# Altium project SISPS-PV-PCB.PrjPcb (part 4 of 4)

## Sheet USB-UART Converter (CP2102).SchDoc: - - - - -
size A4; ApprovedBy: LD Stanton; Author: LD Stanton; CompanyName: University of Cape Town; DrawnBy: Lawrence Stanton; Engineer: Lawrence Stanton; Organization: University of Cape Town; Address1: Department of Electrical Engineering; Address2: Rondebosch; Address3: Cape Town; Address4: South Africa 7701; DocumentNumber: 16; SheetNumber: 16; SheetTotal: 20
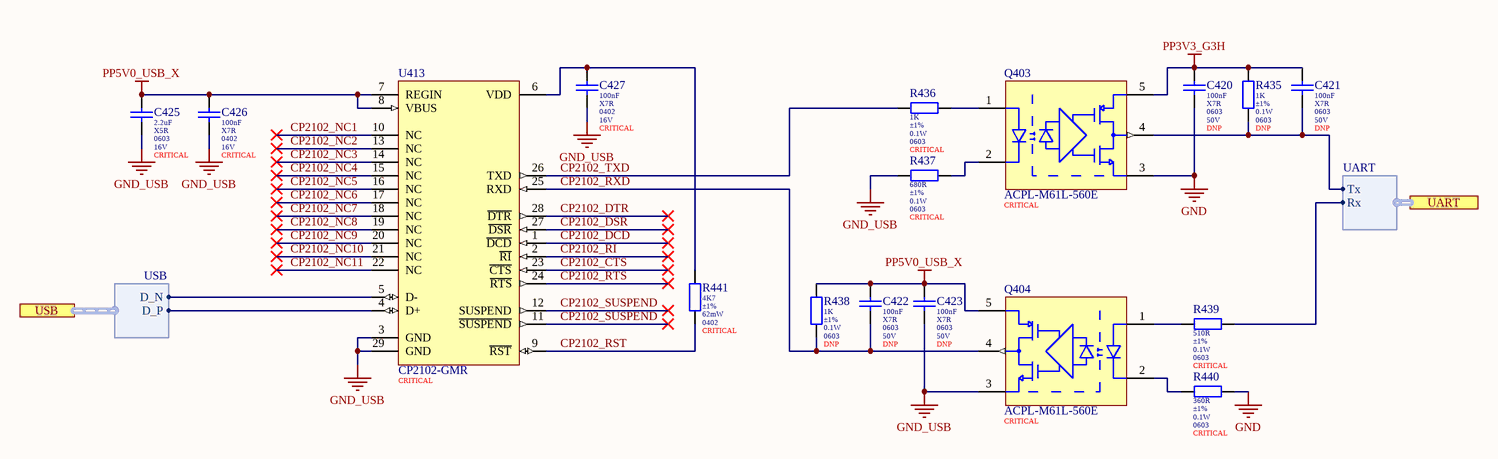
[diagram p15: USB-UART Converter (CP2102).SchDoc]

### Parts
C420  value 100nF  Dielectric: X7R  Package: 0603  Voltage: 50V  Populate: DNP  [0603 (Yageo DA) B]  (hidden comment: CC0603KRX7R9BB104)
C421  value 100nF  Dielectric: X7R  Package: 0603  Voltage: 50V  Populate: DNP  [0603 (Yageo DA) B]  (hidden comment: CC0603KRX7R9BB104)
C422  value 100nF  Dielectric: X7R  Package: 0603  Voltage: 50V  Populate: DNP  [0603 (Yageo DA) B]  (hidden comment: CC0603KRX7R9BB104)
C423  value 100nF  Dielectric: X7R  Package: 0603  Voltage: 50V  Populate: DNP  [0603 (Yageo DA) B]  (hidden comment: CC0603KRX7R9BB104)
C425  value 2.2uF  Dielectric: X5R  Package: 0603  Voltage: 16V  Populate: CRITICAL  [0603_080_8 (Samsung) B]  (hidden comment: CL10A225KO8NNNC)
C426  value 100nF  Dielectric: X7R  Package: 0402  Voltage: 16V  Populate: CRITICAL  [0402_050_5 (Samsumg) B]  (hidden comment: CL05B104KO5NNNC)
C427  value 100nF  Dielectric: X7R  Package: 0402  Voltage: 16V  Populate: CRITICAL  [0402_050_5 (Samsumg) B]  (hidden comment: CL05B104KO5NNNC)
Q403  ACPL-M61L-560E  Placement: CRITICAL  [SO-5 (ACPL) B]
Q404  ACPL-M61L-560E  Placement: CRITICAL  [SO-5 (ACPL) B]
R435  value 1K  Tolerance: ±1%  Power: 0.1W  Package: 0603  Populate: DNP  [0603 (Uniroyal) B]  (hidden comment: 0603WAF1001T5E)
R436  value 1K  Tolerance: ±1%  Power: 0.1W  Package: 0603  Populate: CRITICAL  [0603 (Uniroyal) B]  (hidden comment: 0603WAF1001T5E)
R437  value 680R  Tolerance: ±1%  Power: 0.1W  Package: 0603  Populate: CRITICAL  [0603 (Uniroyal) B]  (hidden comment: 0603WAF6800T5E)
R438  value 1K  Tolerance: ±1%  Power: 0.1W  Package: 0603  Populate: DNP  [0603 (Uniroyal) B]  (hidden comment: 0603WAF1001T5E)
R439  value 510R  Tolerance: ±1%  Power: 0.1W  Package: 0603  Populate: CRITICAL  [0603 (Uniroyal) B]  (hidden comment: 0603WAF5100T5E)
R440  value 360R  Tolerance: ±1%  Power: 0.1W  Package: 0603  Populate: CRITICAL  [0603 (Uniroyal) B]  (hidden comment: 0603WAF3600T5E)
R441  value 4K7  Tolerance: ±1%  Power: 62mW  Package: 0402  Populate: CRITICAL  [0402 (Uniroyal) C]  (hidden comment: 0402WGF4701TCE)
U413  CP2102-GMR  Placement: CRITICAL  [QFN28 (CP2102-GMR) C]

### Ports
UART (harness UART), USB (harness USB)

### Harnesses
USB: D_P, D_N
UART: Rx, Tx

### Nets
GND: C420.2 Q403.3(GND) R440.2
GND_USB: C423.2 C425.2 C426.2 C427.2 Q404.3(GND) R437.1 U413.3(GND) U413.29(GND)
PP3V3_G3H: C420.1 C421.1 Q403.5(VDD) R435.2
PP5V0_USB_X: C422.1 C423.1 C425.1 C426.1 Q404.5(VDD) R438.2 U413.7(REGIN) U413.8(VBUS)
CP2102_CTS: U413.23(~{CTS})
CP2102_DCD: U413.1(~{DCD})
CP2102_DSR: U413.27(~{DSR})
CP2102_DTR: U413.28(~{DTR})
CP2102_NC1: U413.10(NC)
CP2102_NC2: U413.13(NC)
CP2102_NC3: U413.14(NC)
CP2102_NC4: U413.15(NC)
CP2102_NC5: U413.16(NC)
CP2102_NC6: U413.17(NC)
CP2102_NC7: U413.18(NC)
CP2102_NC8: U413.19(NC)
CP2102_NC9: U413.20(NC)
CP2102_NC10: U413.21(NC)
CP2102_NC11: U413.22(NC)
CP2102_RI: U413.2(~{RI})
CP2102_RST: R441.2 U413.9(~{RST})
CP2102_RTS: U413.24(~{RTS})
CP2102_RXD: C422.2 Q404.4(VO) R438.1 U413.25(RXD)
CP2102_~{SUSPEND}: U413.11(~{SUSPEND})
CP2102_SUSPEND: U413.12(SUSPEND)
CP2102_TXD: R436.1 U413.26(TXD)
UART_USB.Rx: R439.2 ; port UART.Rx
UART_USB.Tx: C421.2 Q403.4(VO) R435.1 ; port UART.Tx
USB.D_N: U413.5(D-) ; port USB.D_N
USB.D_P: U413.4(D+) ; port USB.D_P
NetC427_1: C427.1 R441.1 U413.6(VDD)
NetQ403_1: Q403.1(A) R436.2
NetQ403_2: Q403.2(C) R437.2
NetQ404_1: Q404.1(A) R439.1
NetQ404_2: Q404.2(C) R440.1

### Notes on the sheet
- Size:
- Date:
- A4
- Number:
- Time:
- Revision:
- Sheet
- of
- File:
- Author:

### Library data of the parts
C420-C423 = CMP-047-000000-7: MLCC 100nF 50V 0603 X7R ±10%; Manufacturer: Yageo; LCSC Part Number: C14663; Tolerance: ±10%; ComponentLink1URL: https://datasheet.lcsc.com/szlcsc/YAGEO-CC0603KRX7R9BB104_C14663.pdf; ComponentLink1Description: Datasheet
C425 = CMP-045-000016-8: MLCC 2.2uF 0603 16V X5R ±10%; Manufacturer: Samsung; ComponentLink1URL: https://datasheet.lcsc.com/szlcsc/Samsung-Electro-Mechanics-CL05C100JB5NNNC_C32949.pdf; LCSC Part Number: C23630; Tolerance: ±10%; ComponentLink1Description: Datasheet
C426 C427 = CMP-045-000014-12: MLCC 100nF 0402 16V X7R ±10%; Manufacturer: Samsung; ComponentLink1Description: Datasheet; ComponentLink1URL: https://datasheet.lcsc.com/szlcsc/Samsung-Electro-Mechanics-CL05C100JB5NNNC_C32949.pdf; LCSC Part Number: C1525; Tolerance: ±10%
Q403 Q404 = CMP-00026-00000-1: Optocoupler Logic-Out Totem-Pole DC-IN 1-CH SO-5; Propagation Delay: 80ns; Forward Voltage: 1.3V; Forward Current: 2mA; Output Current: 10mA; Isolation Voltage: 3.75kV; ComponentLink1URL: https://datasheet.lcsc.com/lcsc/1912111437_AVAGO-Broadcom-ACPL-M61L-500E_C44908.pdf; Case/Package: SO; ComponentLink1Description: Datasheet; LCSC Part Number: C691956; Min Operating Temperature: -40°C; Max Operating Temperature: 105°C; RoHS Compliant: Yes
R435 R436 R438 = CMP-010-000308-10: Resistor 1K0 0603 ±1% Thick Film Uniroyal; Working Voltage: 50V; Temperature Coefficient: ±100ppm/K; ComponentLink1URL: https://datasheet.lcsc.com/szlcsc/1811062009_UNI-ROYAL-Uniroyal-Elec-0603WAF1002T5E_C25804.pdf; LCSC Part Number: C21190; Pin Count: 2; Manufacturer: Uniroyal; ComponentLink1Description: Datasheet; Temperature: -55 - 155°C
R437 = CMP-010-000394-2: Resistor 680R 0603 ±1% Thick Film Uniroyal; Working Voltage: 50V; Temperature Coefficient: ±100ppm/K; ComponentLink1Description: Datasheet; Pin Count: 2; ComponentLink1URL: https://datasheet.lcsc.com/szlcsc/1811062009_UNI-ROYAL-Uniroyal-Elec-0603WAF1002T5E_C25804.pdf; Temperature: -55 - 155°C; Manufacturer: Uniroyal; LCSC Part Number: C23228
R439 = CMP-010-000390-1: Resistor 510R 0603 ±1% Thick Film Uniroyal; Temperature Coefficient: ±200ppm/K; Working Voltage: 50V; Pin Count: 2; LCSC Part Number: C23193; ComponentLink1URL: https://datasheet.lcsc.com/szlcsc/1811062009_UNI-ROYAL-Uniroyal-Elec-0603WAF1002T5E_C25804.pdf; Temperature: -55 - 155°C; Manufacturer: Uniroyal; ComponentLink1Description: Datasheet
R440 = CMP-010-000392-1: Resistor 360R 0603 ±1% Thick Film Uniroyal; Working Voltage: 50V; Temperature Coefficient: ±200ppm/K; ComponentLink1URL: https://datasheet.lcsc.com/szlcsc/1811062009_UNI-ROYAL-Uniroyal-Elec-0603WAF1002T5E_C25804.pdf; LCSC Part Number: C25194; Temperature: -55 - 155°C; Pin Count: 2; Manufacturer: Uniroyal; ComponentLink1Description: Datasheet
R441 = CMP-010-000338-12: Resistor 4K7 0402 ±1% Thick Film Uniroyal; Temperature Coefficient: ±100ppm/K; Working Voltage: 50V; Temperature: -55 - 155°C; ComponentLink1URL: https://datasheet.lcsc.com/szlcsc/1811062009_UNI-ROYAL-Uniroyal-Elec-0603WAF1002T5E_C25804.pdf; Manufacturer: Uniroyal; LCSC Part Number: C25900; Pin Count: 2; ComponentLink1Description: Datasheet
U413 = CMP-000046-6: USB to UART Bridge QFN28; ComponentLink1Description: Datasheet; Max Operating Temperature: 85°C; LCSC Part Number: C6568; ComponentLink1URL: https://datasheet.lcsc.com/lcsc/1811081920_SILICON-LABS-CP2102-GMR_C6568.pdf; RoHS Compliant: Yes; Case/Package: QFN

## Sheet USB-UART Converter (FT232).SchDoc: Optoisolated USB to UART Converter
size A4; ApprovedBy: LD Stanton; Author: LD Stanton; CompanyName: University of Cape Town; DrawnBy: Lawrence Stanton; Engineer: Lawrence Stanton; Organization: University of Cape Town; Address1: Department of Electrical Engineering; Address2: Rondebosch; Address3: Cape Town; Address4: South Africa 7701; DocumentNumber: 15; SheetNumber: 15; SheetTotal: 20
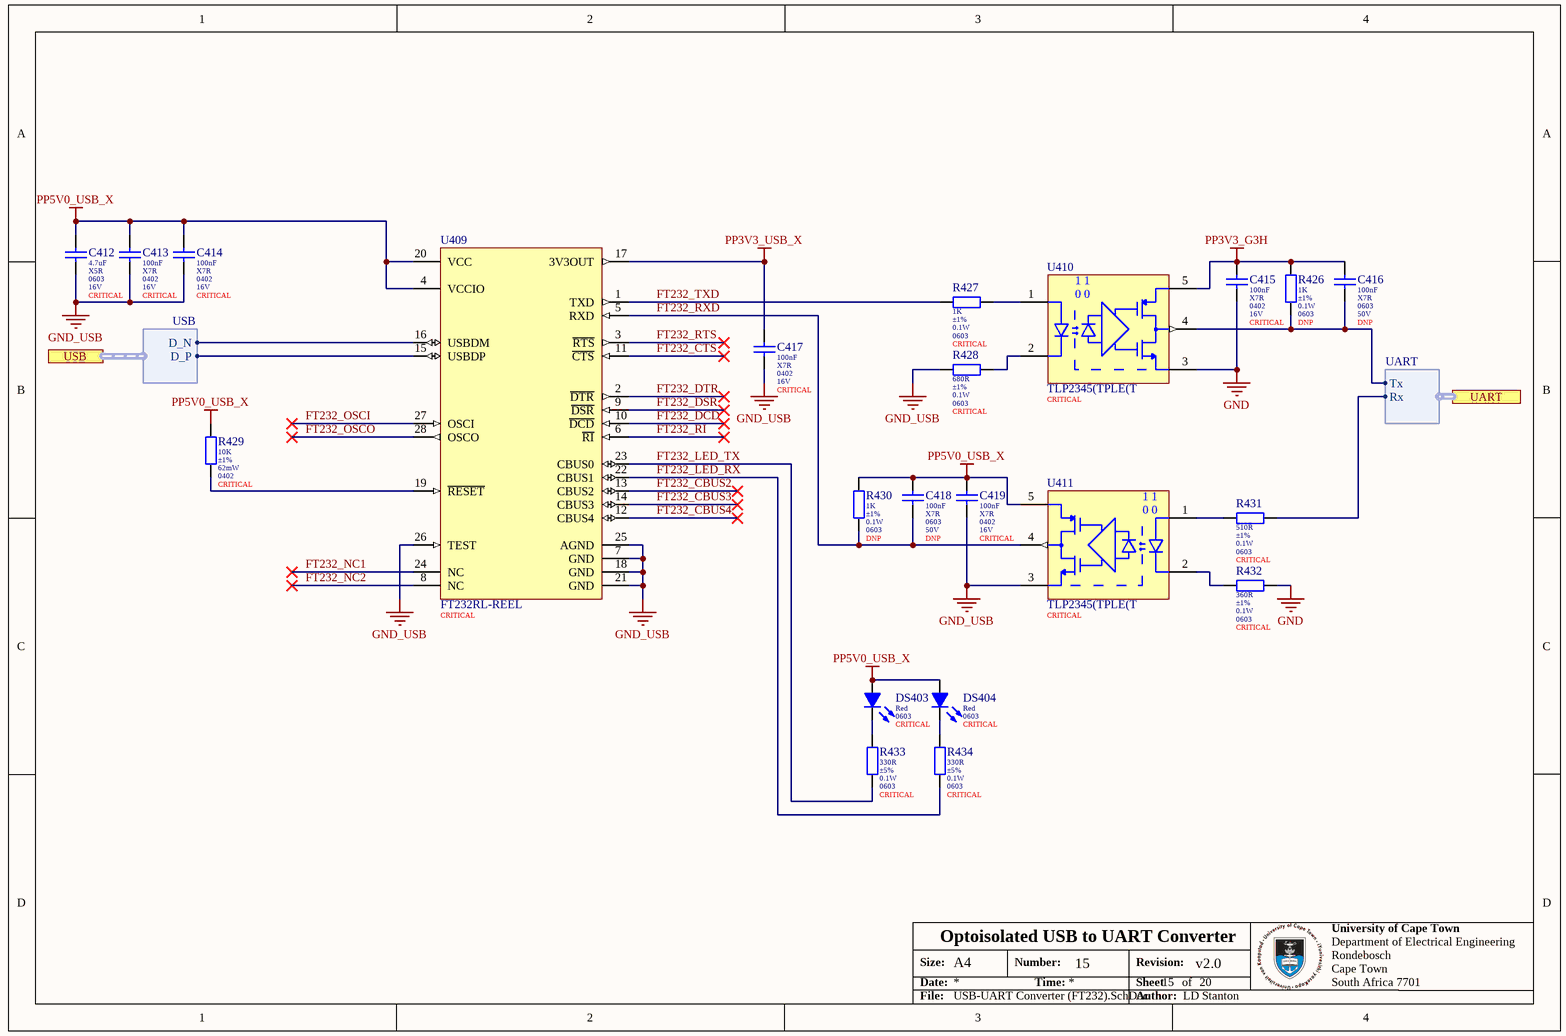
[diagram p16: USB-UART Converter (FT232).SchDoc]

### Parts
C412  value 4.7uF  Dielectric: X5R  Package: 0603  Voltage: 16V  Populate: CRITICAL  [0603_080_8 (Samsung) B]  (hidden comment: CL10A475KO8NNNC)
C413  value 100nF  Dielectric: X7R  Package: 0402  Voltage: 16V  Populate: CRITICAL  [0402_050_5 (Samsumg) B]  (hidden comment: CL05B104KO5NNNC)
C414  value 100nF  Dielectric: X7R  Package: 0402  Voltage: 16V  Populate: CRITICAL  [0402_050_5 (Samsumg) B]  (hidden comment: CL05B104KO5NNNC)
C415  value 100nF  Dielectric: X7R  Package: 0402  Voltage: 16V  Populate: CRITICAL  [0402_050_5 (Samsumg) B]  (hidden comment: CL05B104KO5NNNC)
C416  value 100nF  Dielectric: X7R  Package: 0603  Voltage: 50V  Populate: DNP  [0603 (Yageo DA) B]  (hidden comment: CC0603KRX7R9BB104)
C417  value 100nF  Dielectric: X7R  Package: 0402  Voltage: 16V  Populate: CRITICAL  [0402_050_5 (Samsumg) B]  (hidden comment: CL05B104KO5NNNC)
C418  value 100nF  Dielectric: X7R  Package: 0603  Voltage: 50V  Populate: DNP  [0603 (Yageo DA) B]  (hidden comment: CC0603KRX7R9BB104)
C419  value 100nF  Dielectric: X7R  Package: 0402  Voltage: 16V  Populate: CRITICAL  [0402_050_5 (Samsumg) B]  (hidden comment: CL05B104KO5NNNC)
DS403  Colour: Red  Package: 0603  Placement: CRITICAL  [LED 0603 (Everlight) B]  (hidden comment: 19-217/R6C-AL1M2VY/3T)
DS404  Colour: Red  Package: 0603  Placement: CRITICAL  [LED 0603 (Everlight) B]  (hidden comment: 19-217/R6C-AL1M2VY/3T)
R426  value 1K  Tolerance: ±1%  Power: 0.1W  Package: 0603  Populate: DNP  [0603 (Uniroyal) B]  (hidden comment: 0603WAF1001T5E)
R427  value 1K  Tolerance: ±1%  Power: 0.1W  Package: 0603  Populate: CRITICAL  [0603 (Uniroyal) B]  (hidden comment: 0603WAF1001T5E)
R428  value 680R  Tolerance: ±1%  Power: 0.1W  Package: 0603  Populate: CRITICAL  [0603 (Uniroyal) B]  (hidden comment: 0603WAF6800T5E)
R429  value 10K  Tolerance: ±1%  Power: 62mW  Package: 0402  Populate: CRITICAL  [0402 (Uniroyal) B]  (hidden comment: 0402WGF1002TCE)
R430  value 1K  Tolerance: ±1%  Power: 0.1W  Package: 0603  Populate: DNP  [0603 (Uniroyal) B]  (hidden comment: 0603WAF1001T5E)
R431  value 510R  Tolerance: ±1%  Power: 0.1W  Package: 0603  Populate: CRITICAL  [0603 (Uniroyal) B]  (hidden comment: 0603WAF5100T5E)
R432  value 360R  Tolerance: ±1%  Power: 0.1W  Package: 0603  Populate: CRITICAL  [0603 (Uniroyal) B]  (hidden comment: 0603WAF3600T5E)
R433  value 330R  Tolerance: ±5%  Power: 0.1W  Package: 0603  Populate: CRITICAL  [0603 (Uniroyal) B]  (hidden comment: 0603WAJ0331T5E)
R434  value 330R  Tolerance: ±5%  Power: 0.1W  Package: 0603  Populate: CRITICAL  [0603 (Uniroyal) B]  (hidden comment: 0603WAJ0331T5E)
U409  FT232RL-REEL  Placement: CRITICAL  [SSOP-28 (FT232) B]
U410  TLP2345(TPLE(T  Placement: CRITICAL  [SO-5 (TLP23) B]
U411  TLP2345(TPLE(T  Placement: CRITICAL  [SO-5 (TLP23) B]

### Ports
UART (harness UART), USB (harness USB)

### Harnesses
UART: Rx, Tx
USB: D_P, D_N

### Nets
GND: C415.2 R432.2 U410.3(GND)
GND_USB: C412.2 C413.2 C414.2 C417.2 C419.2 R428.1 U409.7(GND) U409.18(GND) U409.21(GND) U409.25(AGND) U409.26(TEST) U411.3(GND)
PP3V3_G3H: C415.1 C416.1 R426.2 U410.5(VDD)
PP3V3_USB_X: C417.1 U409.17(3V3OUT)
PP5V0_USB_X: C412.1 C413.1 C414.1 C418.1 C419.1 DS403.A DS404.A R429.1 R430.2 U409.4(VCCIO) U409.20(VCC) U411.5(VDD)
FT232_CBUS2: U409.13(CBUS2)
FT232_CBUS3: U409.14(CBUS3)
FT232_CBUS4: U409.12(CBUS4)
FT232_CTS: U409.11(~{CTS})
FT232_DCD: U409.10(~{DCD})
FT232_DSR: U409.9(~{DSR})
FT232_DTR: U409.2(~{DTR})
FT232_LED_RX: R434.2 U409.22(CBUS1)
FT232_LED_TX: R433.2 U409.23(CBUS0)
FT232_NC1: U409.24(NC)
FT232_NC2: U409.8(NC)
FT232_OSCI: U409.27(OSCI)
FT232_OSCO: U409.28(OSCO)
FT232_RI: U409.6(~{RI})
FT232_RTS: U409.3(~{RTS})
FT232_RXD: C418.2 R430.1 U409.5(RXD) U411.4(VO)
FT232_TXD: R427.1 U409.1(TXD)
NetC416_2: C416.2 R426.1 U410.4(VO) ; port UART.Tx
NetDS403_K: DS403.K R433.1
NetDS404_K: DS404.K R434.1
NetR427_2: R427.2 U410.1(A)
NetR428_2: R428.2 U410.2(C)
NetR429_2: R429.2 U409.19(~{RESET})
NetR431_1: R431.1 U411.1(A)
NetR431_2: R431.2 ; port UART.Rx
NetR432_1: R432.1 U411.2(C)
NetU409_15: U409.15(USBDP) ; port USB.D_P
NetU409_16: U409.16(USBDM) ; port USB.D_N

### Notes on the sheet
- Size:
- Date:
- A4
- Number:
- Time:
- Revision:
- Sheet
- of
- File:
- Author:
- (in symbol CMP-00026-00001-3) 1 1; 0 0

### Library data of the parts
C412 = CMP-014-000007-5: MLCC 4.7uF 0603 16V X5R ±10%; Manufacturer: Samsung; LCSC Part Number: C19666; ComponentLink1Description: Datasheet; Tolerance: ±10%; ComponentLink1URL: https://datasheet.lcsc.com/szlcsc/Samsung-Electro-Mechanics-CL05C100JB5NNNC_C32949.pdf
C413-C415 C417 C419 = CMP-045-000014-12: as C426 on sheet USB-UART Converter (CP2102); ComponentLink1Description: Datasheet; ComponentLink1URL: https://datasheet.lcsc.com/szlcsc/Samsung-Electro-Mechanics-CL05C100JB5NNNC_C32949.pdf; LCSC Part Number: C1525; Tolerance: ±10%
C416 C418 = CMP-047-000000-7: as C420-C423 on sheet USB-UART Converter (CP2102); LCSC Part Number: C14663; Tolerance: ±10%; ComponentLink1URL: https://datasheet.lcsc.com/szlcsc/YAGEO-CC0603KRX7R9BB104_C14663.pdf; ComponentLink1Description: Datasheet
DS403 DS404 = CMP-007-00000-1: LED 0603 SMT Red; Manufacturer: Everlight; Maximum Forward Current: 20mA; Forward Voltage: 2.2V; ComponentLink1Description: Datasheet; RoHS Compliant: Yes; ComponentLink1URL: https://datasheet.lcsc.com/lcsc/1811101510_Everlight-Elec-19-217-R6C-AL1M2VY-3T_C72044.pdf; LCSC Part Number: C72044
R426 R427 R430 = CMP-010-000308-10: as R435 on sheet USB-UART Converter (CP2102); ComponentLink1URL: https://datasheet.lcsc.com/szlcsc/1811062009_UNI-ROYAL-Uniroyal-Elec-0603WAF1002T5E_C25804.pdf; LCSC Part Number: C21190; Pin Count: 2; Manufacturer: Uniroyal; ComponentLink1Description: Datasheet; Temperature: -55 - 155°C
R428 = CMP-010-000394-2: as R437 on sheet USB-UART Converter (CP2102); ComponentLink1Description: Datasheet; Pin Count: 2; ComponentLink1URL: https://datasheet.lcsc.com/szlcsc/1811062009_UNI-ROYAL-Uniroyal-Elec-0603WAF1002T5E_C25804.pdf; Temperature: -55 - 155°C; Manufacturer: Uniroyal; LCSC Part Number: C23228
R429 = CMP-010-000292-12: Resistor 10K 0402 ±1% Thick Film Uniroyal; Working Voltage: 50V; Temperature Coefficient: ±100ppm/K; Manufacturer: Uniroyal; Pin Count: 2; ComponentLink1URL: https://datasheet.lcsc.com/szlcsc/1811062009_UNI-ROYAL-Uniroyal-Elec-0603WAF1002T5E_C25804.pdf; LCSC Part Number: C25744; Temperature: -55 - 155°C; ComponentLink1Description: Datasheet
R431 = CMP-010-000390-1: as R439 on sheet USB-UART Converter (CP2102); Pin Count: 2; LCSC Part Number: C23193; ComponentLink1URL: https://datasheet.lcsc.com/szlcsc/1811062009_UNI-ROYAL-Uniroyal-Elec-0603WAF1002T5E_C25804.pdf; Temperature: -55 - 155°C; Manufacturer: Uniroyal; ComponentLink1Description: Datasheet
R432 = CMP-010-000392-1: as R440 on sheet USB-UART Converter (CP2102); ComponentLink1URL: https://datasheet.lcsc.com/szlcsc/1811062009_UNI-ROYAL-Uniroyal-Elec-0603WAF1002T5E_C25804.pdf; LCSC Part Number: C25194; Temperature: -55 - 155°C; Pin Count: 2; Manufacturer: Uniroyal; ComponentLink1Description: Datasheet
R433 R434 = CMP-010-000330-10: Resistor 330R 0603 ±5% Thick Film Uniroyal; Temperature Coefficient: ±100ppm/K; Working Voltage: 50V; ComponentLink1Description: Datasheet; ComponentLink1URL: https://datasheet.lcsc.com/szlcsc/1811062009_UNI-ROYAL-Uniroyal-Elec-0603WAF1002T5E_C25804.pdf; Manufacturer: Uniroyal; Pin Count: 2; Temperature: -55 - 155°C; LCSC Part Number: C23138
U409 = CMP-049-000000-2: USB/UART Converter USB FS SSOP-28 FTDI; Pin Count: 28; LCSC Part Number: C8690; ComponentLink1Description: Datasheet; ComponentLink1URL: https://www.ftdichip.com/Support/Documents/DataSheets/ICs/DS_FT232R.pdf
U410 U411 = CMP-00026-00001-3: Optocoupler Logic-Out Totem-Pole Logic, Buffer-IN 1-CH 5-Pin SO T/R; Forward Voltage: 1V55; Forward Current: 2mA; Output Current: ±50mA; Propagation Delay: 120ns; Isolation Voltage: 3.75kV; LCSC Part Number: C99484; RoHS Compliant: Yes; ComponentLink1Description: Datasheet; Max Operating Temperature: 110°C; ComponentLink1URL: https://datasheet.lcsc.com/lcsc/1811092313_TOSHIBA-TLP2345-TPL,E_C99484.pdf; Case/Package: SO; Min Operating Temperature: -40°C

## Sheet Illustrations 1.SchDoc: Illustrations 1
size A3; ApprovedBy: LD Stanton; Author: LD Stanton; CompanyName: University of Cape Town; DrawnBy: Lawrence Stanton; Engineer: Lawrence Stanton; Organization: University of Cape Town; Address1: Department of Electrical Engineering; Address2: Rondebosch; Address3: Cape Town; Address4: South Africa 7701; DocumentNumber: 18; SheetNumber: 18; SheetTotal: 20
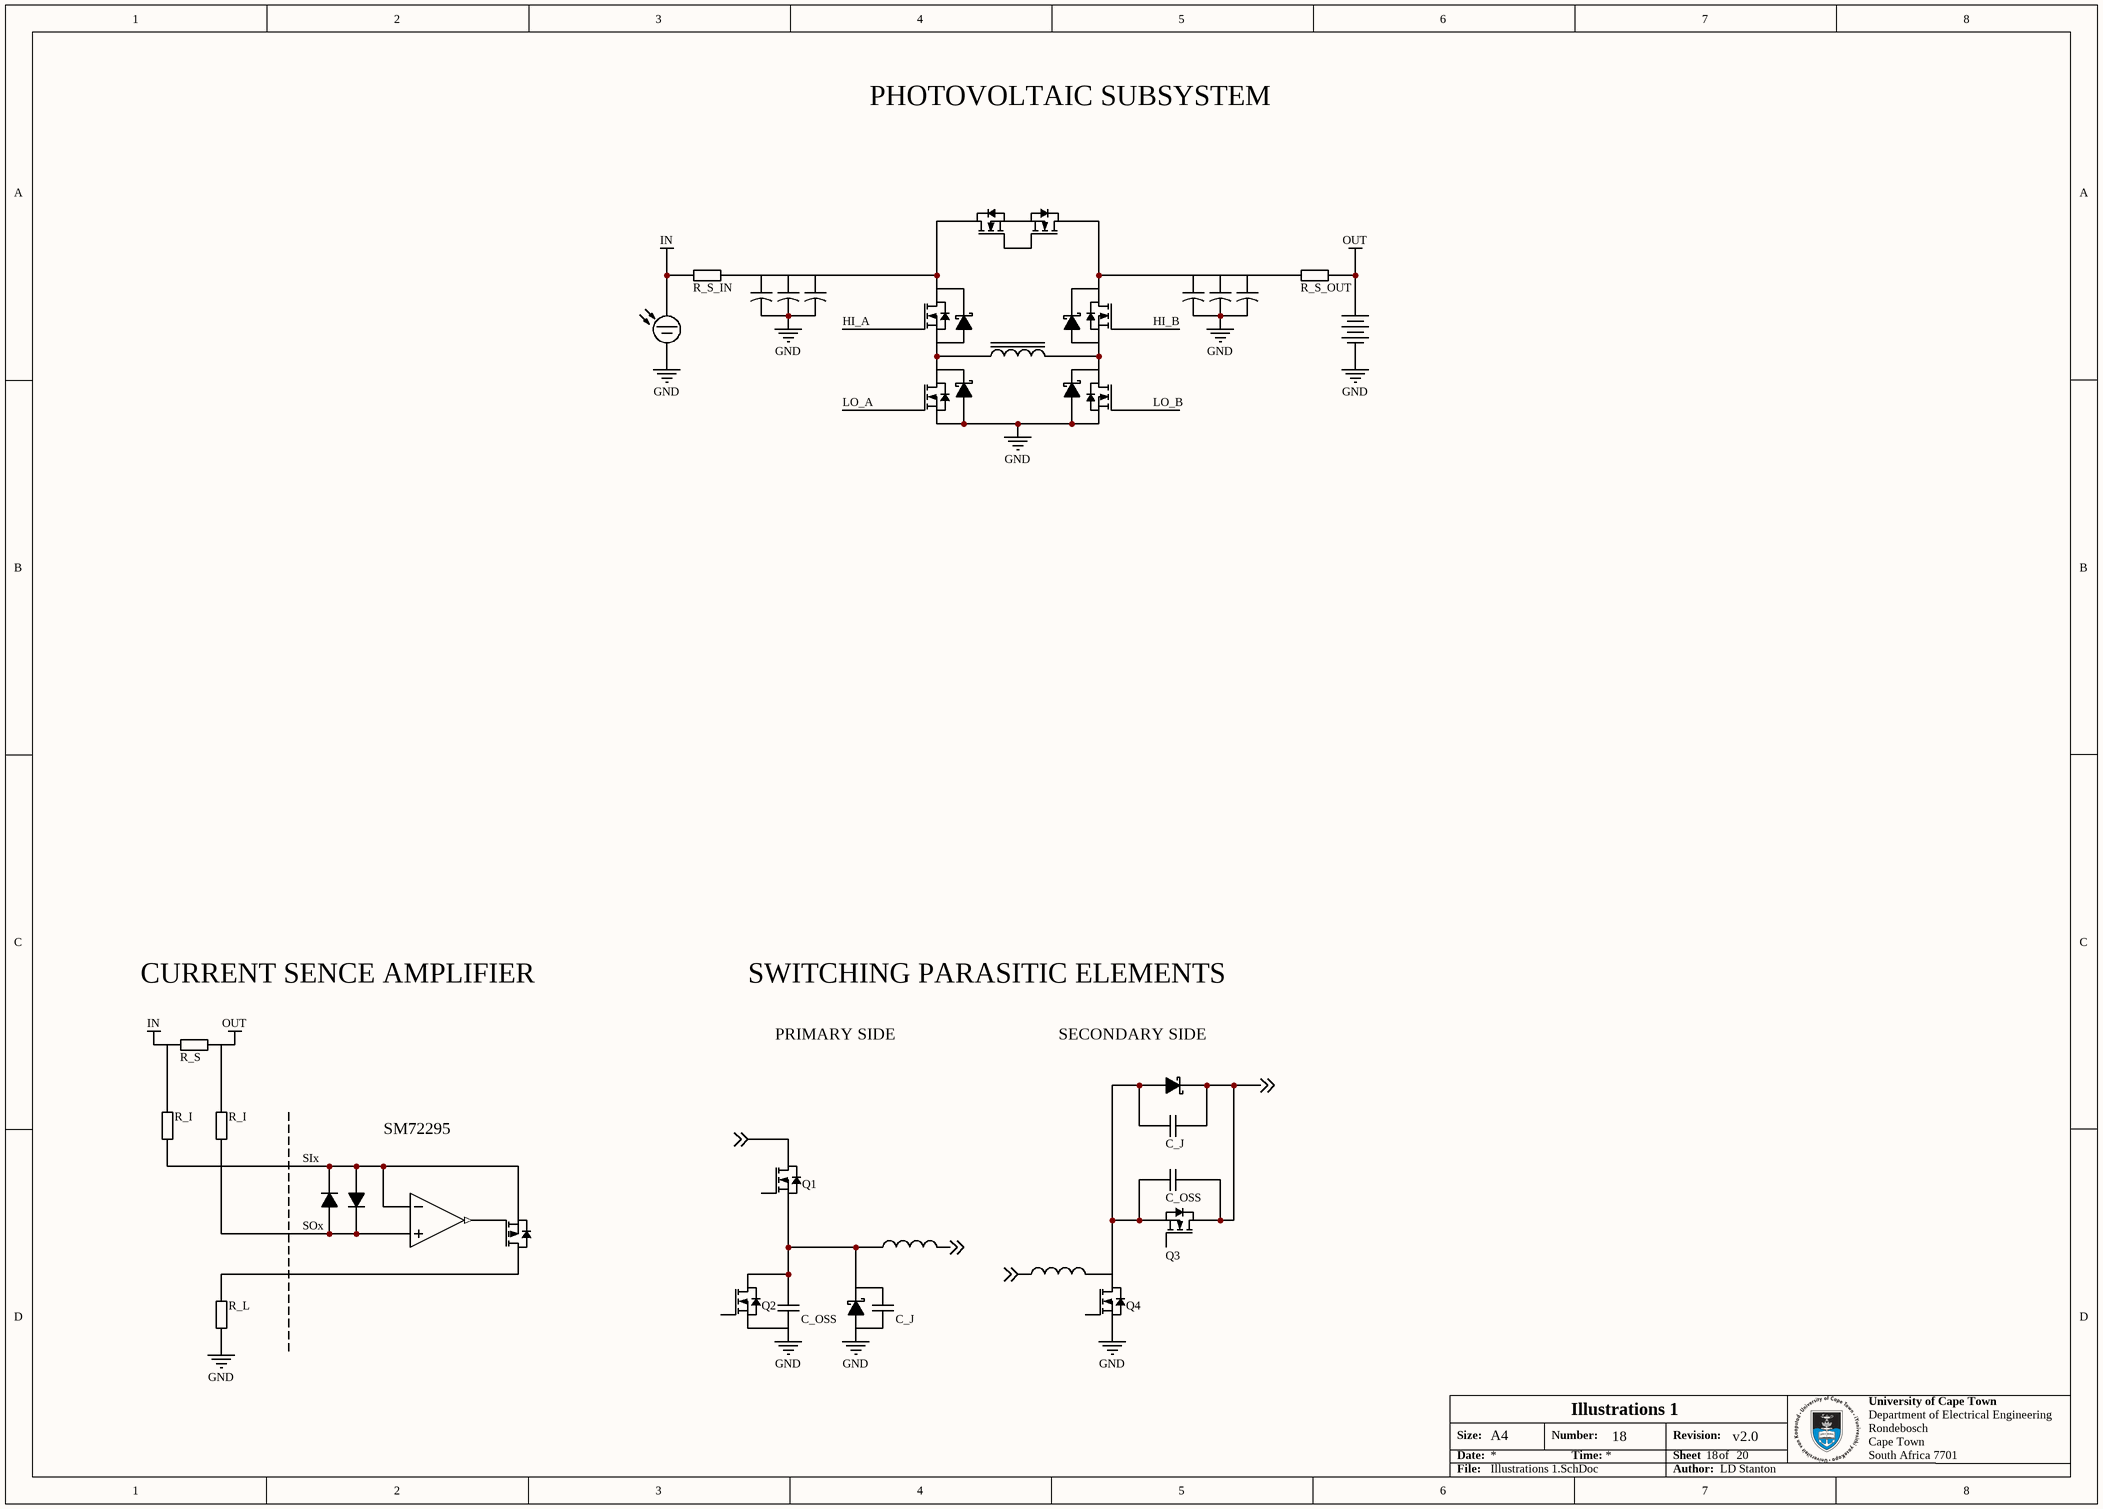
[diagram p17: Illustrations 1.SchDoc]

### Parts
(Parts that share a designator on the sheet are numbered #1, #2 ... from top to bottom, then left to right.)
BT?#1  Photovoltaic Illustration  (value not drawn)  (graphical)
BT?#2  Battery Multicell Illustration  (value not drawn)  (graphical)
C?#1  Capacitor Polarised Illustration  (value not drawn)  (graphical)
C?#2  Capacitor Polarised Illustration  (value not drawn)  (graphical)
C?#3  Capacitor Polarised Illustration  (value not drawn)  (graphical)
C?#4  Capacitor Polarised Illustration  (value not drawn)  (graphical)
C?#5  Capacitor Polarised Illustration  (value not drawn)  (graphical)
C?#6  Capacitor Polarised Illustration  (value not drawn)  (graphical)
C_J#1  Capacitor Non-Polarised Illustration  (value not drawn)  (graphical)
C_J#2  Capacitor Non-Polarised Illustration  (value not drawn)  (graphical)
C_OSS#1  Capacitor Non-Polarised Illustration  (value not drawn)  (graphical)
C_OSS#2  Capacitor Non-Polarised Illustration  (value not drawn)  (graphical)
D?#1  Schottky Diode Illustration  (value not drawn)  (graphical)
D?#2  Schottky Diode Illustration  (value not drawn)  (graphical)
D?#3  Schottky Diode Illustration  (value not drawn)  (graphical)
D?#4  Schottky Diode Illustration  (value not drawn)  (graphical)
D?#5  Schottky Diode Illustration  (value not drawn)  (graphical)
D?#6  Diode Illustration  (value not drawn)  (graphical)
D?#7  Diode Illustration  (value not drawn)  (graphical)
D?#8  Schottky Diode Illustration  (value not drawn)  (graphical)
L?#1  Inductor Core Illustration  (value not drawn)  (graphical)
L?#2  Inductor Illustration  (value not drawn)  (graphical)
L?#3  Inductor Illustration  (value not drawn)  (graphical)
Q1#1  MOSFET N-Channel Illustration  (value not drawn)  (graphical)
Q2#1  MOSFET N-Channel Illustration  (value not drawn)  (graphical)
Q3#1  MOSFET N-Channel Illustration  (value not drawn)  (graphical)
Q4#1  MOSFET N-Channel Illustration  (value not drawn)  (graphical)
Q?#1  MOSFET N-Channel Illustration  (value not drawn)  (graphical)
Q?#2  MOSFET N-Channel Illustration  (value not drawn)  (graphical)
Q?#3  MOSFET N-Channel Illustration  (value not drawn)  (graphical)
Q?#4  MOSFET N-Channel Illustration  (value not drawn)  (graphical)
Q?#5  MOSFET N-Channel Illustration  (value not drawn)  (graphical)
Q?#6  MOSFET N-Channel Illustration  (value not drawn)  (graphical)
Q?#7  MOSFET P-Channel Illustration  (value not drawn)  (graphical)
R_I#1  Resistor Box Illustration  (value not drawn)  (graphical)
R_I#2  Resistor Box Illustration  (value not drawn)  (graphical)
R_L  Resistor Box Illustration  (value not drawn)  (graphical)
R_S  Resistor Box Illustration  (value not drawn)  (graphical)
R_S_IN  Resistor Box Illustration  (value not drawn)  (graphical)
R_S_OUT  Resistor Box Illustration  (value not drawn)  (graphical)
U?#1  Op-Amp Unowered Illustration  (value not drawn)  (graphical)

### Nets
GND: BT?#1.2 BT?#2.2 C?#1.2 C?#2.2 C?#3.2 C?#4.2 C?#5.2 C?#6.2 C_J#2.1 C_OSS#2.2 D?#3.2(A) D?#4.2(A) D?#8.2(A) Q2#1.2(S) Q4#1.2(S) Q?#5.2(S) Q?#6.2(S) R_L.2
IN: BT?#1.1 R_I#1.1 R_S.1 R_S_IN.1
OUT: BT?#2.1 R_I#2.1 R_S.2 R_S_OUT.1
HI_A: Q?#3.1(G)
HI_B: Q?#4.1(G)
LO_A: Q?#5.1(G)
LO_B: Q?#6.1(G)
NetC?#1_1: C?#1.1 C?#2.1 C?#3.1 D?#1.1(K) Q?#1.3(D) Q?#3.3(D) R_S_IN.2
NetC?#4_1: C?#4.1 C?#5.1 C?#6.1 D?#2.1(K) Q?#2.3(D) Q?#4.3(D) R_S_OUT.2
NetC_J#1_1: C_J#1.1 C_OSS#1.1 D?#5.2(A) L?#3.2 Q3#1.2(S) Q4#1.3(D)
NetC_J#1_2: C_J#1.2 C_OSS#1.2 D?#5.1(K) L?#2.2 L?#3.1 Q1#1.3(D) Q3#1.3(D) ; off-sheet 
NetC_J#2_2: C_J#2.2 C_OSS#2.1 D?#8.1(K) L?#2.1 Q1#1.2(S) Q2#1.3(D)
NetD?#1_2: D?#1.2(A) D?#3.1(K) L?#1.1 Q?#3.2(S) Q?#5.3(D)
NetD?#2_2: D?#2.2(A) D?#4.1(K) L?#1.2 Q?#4.2(S) Q?#6.3(D)
NetD?#6_1: D?#6.1(K) D?#7.2(A) R_I#2.2 U?#1.2(1IN+)
NetD?#6_2: D?#6.2(A) D?#7.1(K) Q?#7.2(S) R_I#1.2 U?#1.1(1IN-)
NetQ?#1_1: Q?#1.1(G) Q?#2.1(G)
NetQ?#1_2: Q?#1.2(S) Q?#2.2(S)
NetQ?#7_1: Q?#7.1(G) U?#1.3(OUT)
NetQ?#7_3: Q?#7.3(D) R_L.1

Not connected (* = marked no-connect by the designer): Q1#1 1(G); Q2#1 1(G); Q3#1 1(G); Q4#1 1(G)

### Notes on the sheet
- PHOTOVOLTAIC SUBSYSTEM
- CURRENT SENCE AMPLIFIER
- SWITCHING PARASITIC ELEMENTS
- PRIMARY SIDE
- (near D?#5) SECONDARY SIDE
- (near D?#7) SIx
- SM72295
- (near D?#7) SOx
- Size:
- Date:
- A4
- Number:
- Time:
- Revision:
- Sheet
- of
- File:
- Author:

### Library data of the parts
BT?#1 = CMP-000016-2: Solar Cell or Panel for Illustration; Short Circuit Current: 0A; Power: 0W; Open Circuit Voltage: 0V
BT?#2 = CMP-00015-2: Multicell Battery for Illustration; Value: 0A; Placement: CRITICAL
C?#1-C?#6 = CMP-000004-8: Polarised Capacitor for Illustration; Value: 0F; Temperature Coefficient: ±0ppm/K; Tolerance: ±0%; Voltage: 0V; Placement: CRITICAL; Temperature: -0 - 0°C; Package: 0000
C_J#1 C_J#2 C_OSS#1 C_OSS#2 = CMP-000003-10: Non-Polarised Capacitor for Illustration.; Value: 0F; Tolerance: ±0%; Temperature Coefficient: ±0ppm/K; Placement: CRITICAL; Voltage: 0V; Package: 0000; Temperature: -0 - 0°C
D?#1-D?#5 D?#8 = CMP-00003-5: Schottky Diode for Ilustration; Forward Current: 0A0; Placement: CRITICAL; Blocking Voltage: 0V0; Temperature: -0 - 0°C; Forward Voltage: 0V0
D?#6 D?#7 = CMP-00005-4: General Diode for Ilustration; Forward Voltage: 0V0; Placement: CRITICAL; Forward Current: 0A0; Temperature: -0 - 0°C; Blocking Voltage: 0V0
L?#1 = CMP-00048-1: General Inductor with Magnetic Core for Illustration; Value: 0H; Resistance: 0K0; Saturation Current: 0A; Placement: CRITICAL; Temperature Coefficient: ±0ppm/K; Tolerance: ±0%; Temperature: -0 - 0°C; Rated Current: 0A
L?#2 L?#3 = CMP-000009-4: General Inductor for Illustration; Value: 0H; Rated Current: 0A; Tolerance: ±0%; Temperature Coefficient: ±0ppm/K; Placement: CRITICAL; Resistance: 0K0; Temperature: -0 - 0°C; Saturation Current: 0A
Q1#1 Q2#1 Q3#1 Q4#1 Q?#1-Q?#6 = CMP-000008-5: N-Channel MOSFET 3-Terminal for Illustration; Current: 0A; Gate Threshold Voltage: 0V; Placement: CRITICAL; Temperature: -0 - 0°C; Gate-Source Voltage: 0V; Drain-Source Voltage: 0V
Q?#7 = CMP-00001-3: P-Channel MOSFET 3-Terminal for Illustration; Drain-Source Voltage: 0V; Current: 0A; Placement: CRITICAL; Gate-Source Voltage: 0V; Gate Threshold Voltage: 0V; Temperature: -0 - 0°C
R_I#1 R_I#2 R_L R_S R_S_IN R_S_OUT = CMP-010-000360-14: Resistor for Illustration. Box Symbol.; Value: 0K0; Working Voltage: 0V; Power: 0W; Placement: CRITICAL; Tolerance: ±0%; Temperature Coefficient: ±0ppm/K; Package: 0000; Temperature: -0 - 0°C
U?#1 = CMP-00064-1: Operational Amplifier without Power Pins for Illustration; Placement: CRITICAL; Temperature: -0 - 0°C

## Sheet Illustrations 2.SchDoc: Illustrations 2
size A3; ApprovedBy: LD Stanton; Author: LD Stanton; CompanyName: University of Cape Town; DrawnBy: Lawrence Stanton; Engineer: Lawrence Stanton; Organization: University of Cape Town; Address1: Department of Electrical Engineering; Address2: Rondebosch; Address3: Cape Town; Address4: South Africa 7701; DocumentNumber: 19; SheetNumber: 19; SheetTotal: 20
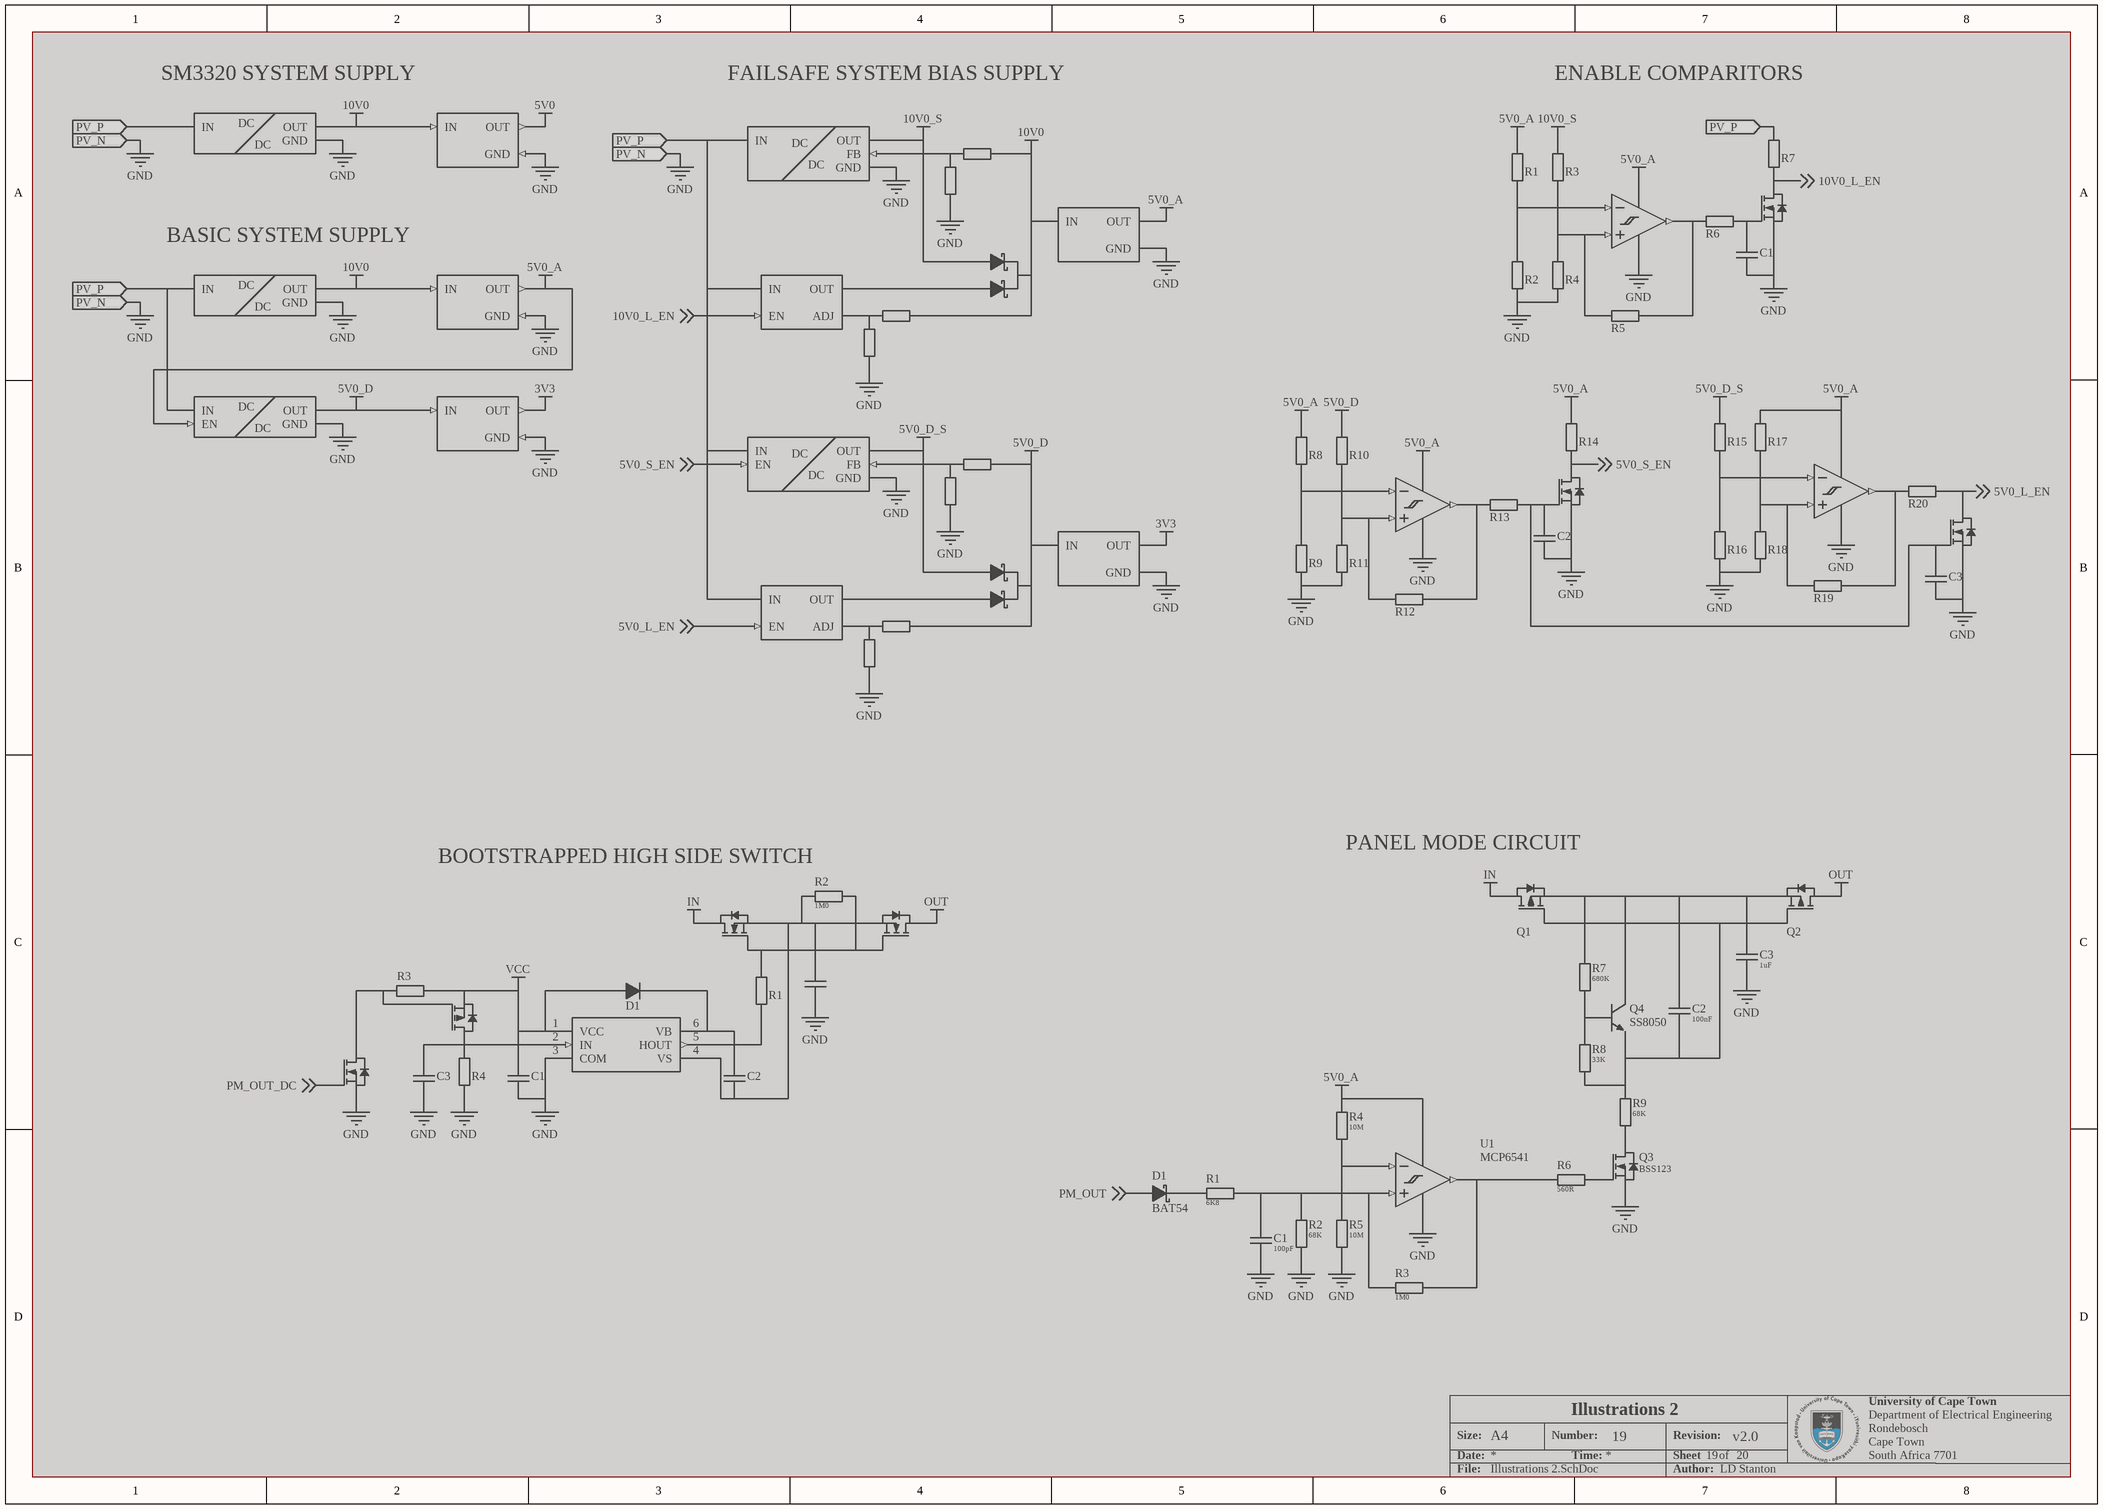
[diagram p18: Illustrations 2.SchDoc]

### Parts
(Parts that share a designator on the sheet are numbered #1, #2 ... from top to bottom, then left to right.)
C1#1  Capacitor Non-Polarised Illustration  (value not drawn)  (graphical)  (masked out: inside a compile mask, not in the netlist)
C1#2  Capacitor Non-Polarised Illustration  (value not drawn)  (graphical)  (masked out: inside a compile mask, not in the netlist)
C1#3  value 100pF  (hidden comment: Capacitor Non-Polarised Illustration)  (graphical)  (masked out: inside a compile mask, not in the netlist)
C2#1  Capacitor Non-Polarised Illustration  (value not drawn)  (graphical)  (masked out: inside a compile mask, not in the netlist)
C2#2  value 100nF  (hidden comment: Capacitor Non-Polarised Illustration)  (graphical)  (masked out: inside a compile mask, not in the netlist)
C2#3  Capacitor Non-Polarised Illustration  (value not drawn)  (graphical)  (masked out: inside a compile mask, not in the netlist)
C3#1  Capacitor Non-Polarised Illustration  (value not drawn)  (graphical)  (masked out: inside a compile mask, not in the netlist)
C3#2  value 1uF  (hidden comment: Capacitor Non-Polarised Illustration)  (graphical)  (masked out: inside a compile mask, not in the netlist)
C3#3  Capacitor Non-Polarised Illustration  (value not drawn)  (graphical)  (masked out: inside a compile mask, not in the netlist)
C3#4  Capacitor Non-Polarised Illustration  (value not drawn)  (graphical)  (masked out: inside a compile mask, not in the netlist)
D1#1  Diode Illustration  (value not drawn)  (graphical)  (masked out: inside a compile mask, not in the netlist)
D1#2  BAT54  (graphical)  (masked out: inside a compile mask, not in the netlist)
D?#9  Schottky Dual Common Cathode Illustration  (value not drawn)  (graphical)  (masked out: inside a compile mask, not in the netlist)
D?#10  Schottky Dual Common Cathode Illustration  (value not drawn)  (graphical)  (masked out: inside a compile mask, not in the netlist)
Q1#2  MOSFET P-Channel Illustration  (value not drawn)  (graphical)  (masked out: inside a compile mask, not in the netlist)
Q2#2  MOSFET P-Channel Illustration  (value not drawn)  (graphical)  (masked out: inside a compile mask, not in the netlist)
Q3#2  BSS123  (graphical)  (masked out: inside a compile mask, not in the netlist)
Q4#2  SS8050  (graphical)  (masked out: inside a compile mask, not in the netlist)
Q?#8  MOSFET N-Channel Illustration  (value not drawn)  (graphical)  (masked out: inside a compile mask, not in the netlist)
Q?#9  MOSFET N-Channel Illustration  (value not drawn)  (graphical)  (masked out: inside a compile mask, not in the netlist)
Q?#10  MOSFET N-Channel Illustration  (value not drawn)  (graphical)  (masked out: inside a compile mask, not in the netlist)
Q?#11  MOSFET N-Channel Illustration  (value not drawn)  (graphical)  (masked out: inside a compile mask, not in the netlist)
Q?#12  MOSFET N-Channel Illustration  (value not drawn)  (graphical)  (masked out: inside a compile mask, not in the netlist)
Q?#13  MOSFET P-Channel Illustration  (value not drawn)  (graphical)  (masked out: inside a compile mask, not in the netlist)
Q?#14  MOSFET N-Channel Illustration  (value not drawn)  (graphical)  (masked out: inside a compile mask, not in the netlist)
R1#1  Resistor Box Illustration  (value not drawn)  (graphical)  (masked out: inside a compile mask, not in the netlist)
R1#2  Resistor Box Illustration  (value not drawn)  (graphical)  (masked out: inside a compile mask, not in the netlist)
R1#3  value 6K8  (hidden comment: Resistor Box Illustration)  (graphical)  (masked out: inside a compile mask, not in the netlist)
R2#1  Resistor Box Illustration  (value not drawn)  (graphical)  (masked out: inside a compile mask, not in the netlist)
R2#2  value 1M0  (hidden comment: Resistor Box Illustration)  (graphical)  (masked out: inside a compile mask, not in the netlist)
R2#3  value 68K  (hidden comment: Resistor Box Illustration)  (graphical)  (masked out: inside a compile mask, not in the netlist)
R3#1  Resistor Box Illustration  (value not drawn)  (graphical)  (masked out: inside a compile mask, not in the netlist)
R3#2  Resistor Box Illustration  (value not drawn)  (graphical)  (masked out: inside a compile mask, not in the netlist)
R3#3  value 1M0  (hidden comment: Resistor Box Illustration)  (graphical)  (masked out: inside a compile mask, not in the netlist)
R4#1  Resistor Box Illustration  (value not drawn)  (graphical)  (masked out: inside a compile mask, not in the netlist)
R4#2  Resistor Box Illustration  (value not drawn)  (graphical)  (masked out: inside a compile mask, not in the netlist)
R4#3  value 10M  (hidden comment: Resistor Box Illustration)  (graphical)  (masked out: inside a compile mask, not in the netlist)
R5#1  Resistor Box Illustration  (value not drawn)  (graphical)  (masked out: inside a compile mask, not in the netlist)
R5#2  value 10M  (hidden comment: Resistor Box Illustration)  (graphical)  (masked out: inside a compile mask, not in the netlist)
R6#1  Resistor Box Illustration  (value not drawn)  (graphical)  (masked out: inside a compile mask, not in the netlist)
R6#2  value 560R  (hidden comment: Resistor Box Illustration)  (graphical)  (masked out: inside a compile mask, not in the netlist)
R7#1  Resistor Box Illustration  (value not drawn)  (graphical)  (masked out: inside a compile mask, not in the netlist)
R7#2  value 680K  (hidden comment: Resistor Box Illustration)  (graphical)  (masked out: inside a compile mask, not in the netlist)
R8#1  Resistor Box Illustration  (value not drawn)  (graphical)  (masked out: inside a compile mask, not in the netlist)
R8#2  value 33K  (hidden comment: Resistor Box Illustration)  (graphical)  (masked out: inside a compile mask, not in the netlist)
R9#1  Resistor Box Illustration  (value not drawn)  (graphical)  (masked out: inside a compile mask, not in the netlist)
R9#2  value 68K  (hidden comment: Resistor Box Illustration)  (graphical)  (masked out: inside a compile mask, not in the netlist)
R10  Resistor Box Illustration  (value not drawn)  (graphical)  (masked out: inside a compile mask, not in the netlist)
R11  Resistor Box Illustration  (value not drawn)  (graphical)  (masked out: inside a compile mask, not in the netlist)
R12  Resistor Box Illustration  (value not drawn)  (graphical)  (masked out: inside a compile mask, not in the netlist)
R13  Resistor Box Illustration  (value not drawn)  (graphical)  (masked out: inside a compile mask, not in the netlist)
R14  Resistor Box Illustration  (value not drawn)  (graphical)  (masked out: inside a compile mask, not in the netlist)
R15  Resistor Box Illustration  (value not drawn)  (graphical)  (masked out: inside a compile mask, not in the netlist)
R16  Resistor Box Illustration  (value not drawn)  (graphical)  (masked out: inside a compile mask, not in the netlist)
R17  Resistor Box Illustration  (value not drawn)  (graphical)  (masked out: inside a compile mask, not in the netlist)
R18  Resistor Box Illustration  (value not drawn)  (graphical)  (masked out: inside a compile mask, not in the netlist)
R19  Resistor Box Illustration  (value not drawn)  (graphical)  (masked out: inside a compile mask, not in the netlist)
R20  Resistor Box Illustration  (value not drawn)  (graphical)  (masked out: inside a compile mask, not in the netlist)
R?#1  Resistor Box Illustration  (value not drawn)  (graphical)  (masked out: inside a compile mask, not in the netlist)
R?#2  Resistor Box Illustration  (value not drawn)  (graphical)  (masked out: inside a compile mask, not in the netlist)
R?#3  Resistor Box Illustration  (value not drawn)  (graphical)  (masked out: inside a compile mask, not in the netlist)
R?#4  Resistor Box Illustration  (value not drawn)  (graphical)  (masked out: inside a compile mask, not in the netlist)
R?#5  Resistor Box Illustration  (value not drawn)  (graphical)  (masked out: inside a compile mask, not in the netlist)
R?#6  Resistor Box Illustration  (value not drawn)  (graphical)  (masked out: inside a compile mask, not in the netlist)
R?#7  Resistor Box Illustration  (value not drawn)  (graphical)  (masked out: inside a compile mask, not in the netlist)
R?#8  Resistor Box Illustration  (value not drawn)  (graphical)  (masked out: inside a compile mask, not in the netlist)
U1#1  MCP6541  (graphical)  (masked out: inside a compile mask, not in the netlist)
U?#2  DC/DC Nonisolated Enable Illustration  (value not drawn)  (graphical)  (masked out: inside a compile mask, not in the netlist)
U?#3  Linear Regulator Fixed Illustration  (value not drawn)  (graphical)  (masked out: inside a compile mask, not in the netlist)
U?#4  DC/DC Nonisolated Feedback Illustration  (value not drawn)  (graphical)  (masked out: inside a compile mask, not in the netlist)
U?#5  Comparator Powered Illustration  (value not drawn)  (graphical)  (masked out: inside a compile mask, not in the netlist)
U?#6  Linear Regulator Fixed Illustration  (value not drawn)  (graphical)  (masked out: inside a compile mask, not in the netlist)
U?#7  DC/DC Nonisolated Enable Illustration  (value not drawn)  (graphical)  (masked out: inside a compile mask, not in the netlist)
U?#8  Linear Regulator Fixed Illustration  (value not drawn)  (graphical)  (masked out: inside a compile mask, not in the netlist)
U?#9  Linear Regulator Adjustible Enable Illustration  (value not drawn)  (graphical)  (masked out: inside a compile mask, not in the netlist)
U?#10  DC/DC Nonisolated Enable Illustration  (value not drawn)  (graphical)  (masked out: inside a compile mask, not in the netlist)
U?#11  Linear Regulator Fixed Illustration  (value not drawn)  (graphical)  (masked out: inside a compile mask, not in the netlist)
U?#12  DC/DC Nonisolated Feedback Enable Illustration  (value not drawn)  (graphical)  (masked out: inside a compile mask, not in the netlist)
U?#13  Comparator Powered Illustration  (value not drawn)  (graphical)  (masked out: inside a compile mask, not in the netlist)
U?#14  Comparator Powered Illustration  (value not drawn)  (graphical)  (masked out: inside a compile mask, not in the netlist)
U?#15  Linear Regulator Fixed Illustration  (value not drawn)  (graphical)  (masked out: inside a compile mask, not in the netlist)
U?#16  Linear Regulator Adjustible Enable Illustration  (value not drawn)  (graphical)  (masked out: inside a compile mask, not in the netlist)
U?#17  Gate Driver Illustration  (value not drawn)  (graphical)  (masked out: inside a compile mask, not in the netlist)

### Ports
PV_N (in), PV_P (in)

### Notes on the sheet
- (near U?#2) SM3320 SYSTEM SUPPLY
- FAILSAFE SYSTEM BIAS SUPPLY
- ENABLE COMPARITORS
- (near U?#7) BASIC SYSTEM SUPPLY
- BOOTSTRAPPED HIGH SIDE SWITCH
- (near Q1#2) PANEL MODE CIRCUIT
- Size:
- Date:
- A4
- Number:
- Time:
- Revision:
- Sheet
- of
- File:
- Author:
- (in symbol CMP-00058-3) DC
- (in symbol CMP-00059-1) DC
- (in symbol CMP-00061-1) DC
- (in symbol CMP-00062-1) DC

### Library data of the parts
C1#1 C1#2 C2#1 C2#3 C3#1 C3#3 C3#4 = CMP-000003-10: as C_J#1 on sheet Illustrations 1; Package: 0000; Temperature: -0 - 0°C
C1#3 C2#2 C3#2 = CMP-000003-10: Non-Polarised Capacitor for Illustration.; Tolerance: ±0%; Temperature Coefficient: ±0ppm/K; Placement: CRITICAL; Voltage: 0V; Package: 0000; Temperature: -0 - 0°C
D1#1 = CMP-00005-4: as D?#6 on sheet Illustrations 1; Temperature: -0 - 0°C; Blocking Voltage: 0V0
D1#2 = CMP-00003-5: as D?#1 on sheet Illustrations 1; Temperature: -0 - 0°C; Forward Voltage: 0V0
D?#9 D?#10 = CMP-00060-1: Common Cathode Schottky Diode Pair for Ilustration; Forward Voltage: 0V0; Placement: CRITICAL; Forward Current: 0A0; Blocking Voltage: 0V0; Temperature: -0 - 0°C
Q1#2 Q2#2 Q?#13 = CMP-00001-3: as Q?#7 on sheet Illustrations 1; Gate-Source Voltage: 0V; Gate Threshold Voltage: 0V; Temperature: -0 - 0°C
Q3#2 Q?#8-Q?#12 Q?#14 = CMP-000008-5: as Q1#1 on sheet Illustrations 1; Temperature: -0 - 0°C; Gate-Source Voltage: 0V; Drain-Source Voltage: 0V
Q4#2 = CMP-000010-3: NPN Bipolar Junction Transistor for Illustration; Collector Current: 0A; Collector-Emitter Voltage: 0V; Power: 0W; Placement: CRITICAL; Temperature: -0 - 0°C; Saturation Voltgae: 0V
R1#1 R1#2 R2#1 R3#1 R3#2 R4#1 R4#2 R5#1 R6#1 R7#1 R8#1 R9#1 R10-R20 R?#1-R?#8 = CMP-010-000360-14: as R_I#1 on sheet Illustrations 1; Package: 0000; Temperature: -0 - 0°C
R1#3 R2#2 R2#3 R3#3 R4#3 R5#2 R6#2 R7#2 R8#2 R9#2 = CMP-010-000360-14: Resistor for Illustration. Box Symbol.; Working Voltage: 0V; Power: 0W; Placement: CRITICAL; Tolerance: ±0%; Temperature Coefficient: ±0ppm/K; Package: 0000; Temperature: -0 - 0°C
U1#1 U?#5 U?#13 U?#14 = CMP-00063-3: Comparator with Power Pins for Illustration; Placement: CRITICAL; Temperature: -0 - 0°C
U?#2 U?#7 = CMP-00059-1: Nonisolated DC/DC Converter with Enable for Illustration; Placement: CRITICAL
U?#3 U?#8 U?#11 = CMP-00057-1: Fixed Linear Regulator for Illustration; Placement: CRITICAL
U?#4 = CMP-00062-1: Nonisolated DC/DC Converter with Feedback for Illustration; Placement: CRITICAL
U?#6 U?#15 = CMP-00057-3: Fixed Linear Regulator for Illustration; Placement: CRITICAL
U?#9 U?#16 = CMP-00055-3: Adjustible Linear Regulator with Enable for Illustration; Placement: CRITICAL
U?#10 = CMP-00058-3: Nonisolated DC/DC Converter with Enable for Illustration; Placement: CRITICAL
U?#12 = CMP-00061-1: Nonisolated DC/DC Converter with Feedback and Enable for Illustration; Placement: CRITICAL
U?#17 = CMP-000027-2: Simple Gate Driver IC for Illustration

## Sheet Simulation 1.SchDoc: Panel Mode Enable Simulation
size A4; ApprovedBy: LD Stanton; Author: LD Stanton; CompanyName: University of Cape Town; DrawnBy: Lawrence Stanton; Engineer: Lawrence Stanton; Organization: University of Cape Town; Address1: Department of Electrical Engineering; Address2: Rondebosch; Address3: Cape Town; Address4: South Africa 7701; DocumentNumber: 20; SheetNumber: 20; SheetTotal: 20
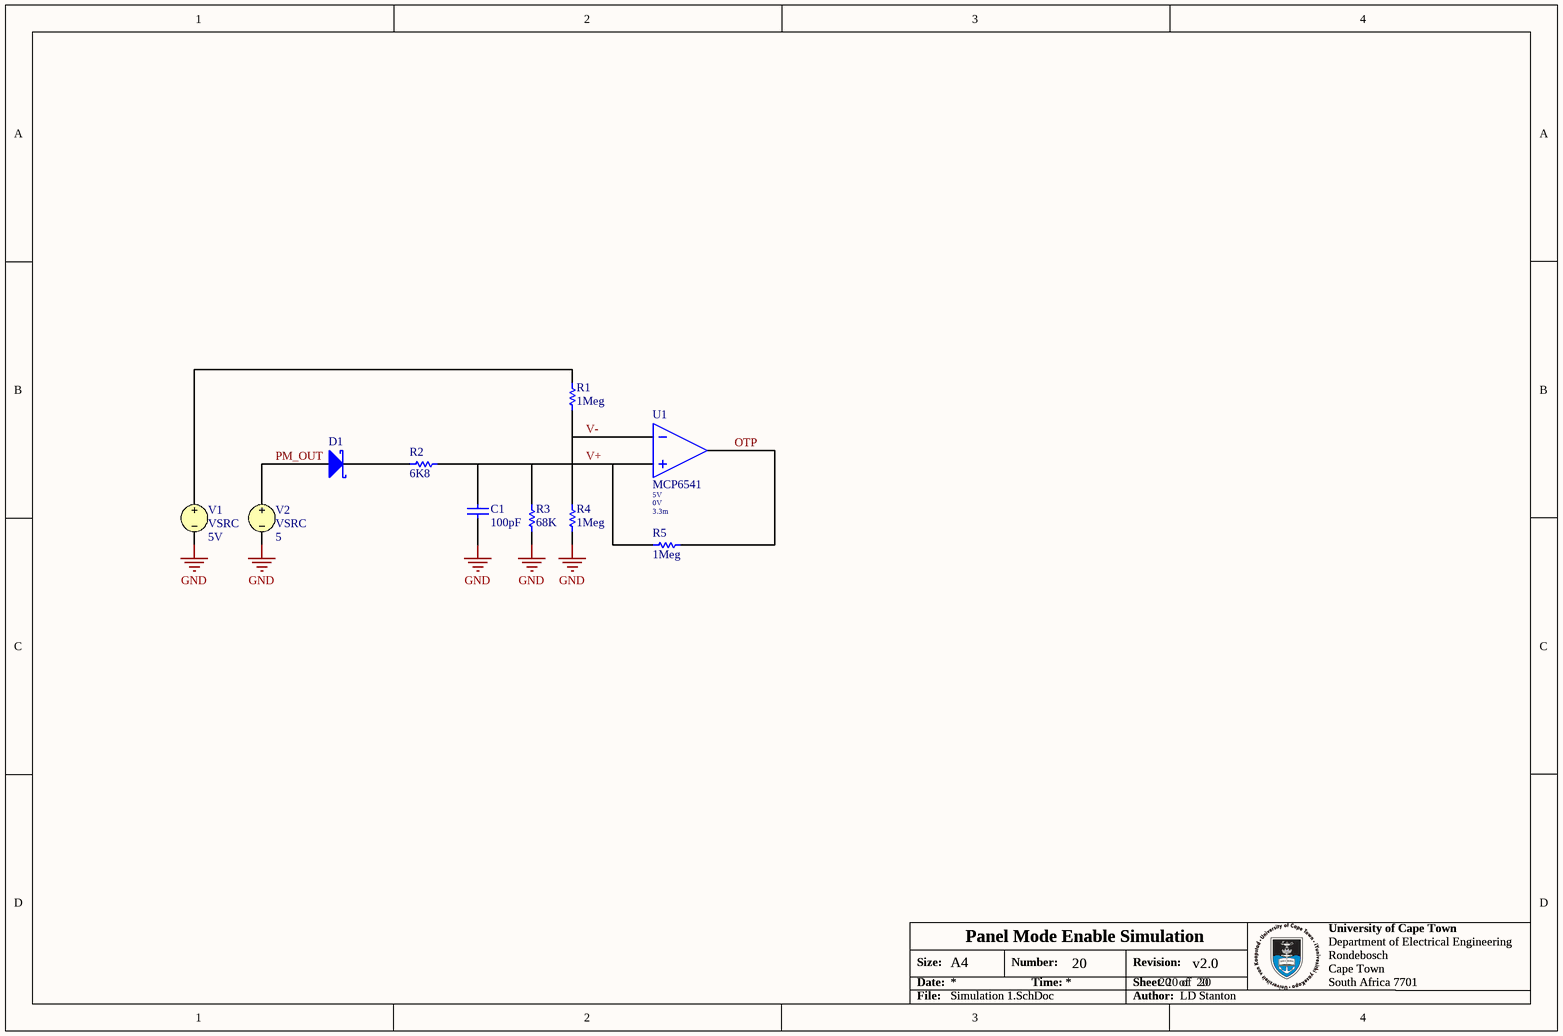
[diagram p19: Simulation 1.SchDoc]

### Parts
(Parts that share a designator on the sheet are numbered #1, #2 ... from top to bottom, then left to right.)
C1#4  value 100pF  (hidden comment: Capacitor)
D1#3  Shottky Diode  (value not drawn)
R1#4  value 1Meg  (hidden comment: Resistor)
R2#4  value 6K8  (hidden comment: Resistor)
R3#4  value 68K  (hidden comment: Resistor)
R4#4  value 1Meg  (hidden comment: Resistor)
R5#3  value 1Meg  (hidden comment: Resistor)
U1#2  MCP6541  VHIGH: 5V  VLOW: 0V  VHYS: 3.3m
V1  VSRC  value 5V
V2  VSRC  DC Magnitude: 5

### Nets
GND: C1#4.1 R3#4.1 R4#4.1 V1.2 V2.2
OTP: R5#3.2 U1#2.3(OUT)
PM_OUT: D1#3.1(A) V2.1
V+: C1#4.2 R2#4.2 R3#4.2 R5#3.1 U1#2.2(IN+)
V-: R1#4.1 R4#4.2 U1#2.1(IN-)
NetD1#3_2: D1#3.2(K) R2#4.1
NetR1#4_2: R1#4.2 V1.1

### Notes on the sheet
- Size:
- Date:
- A4
- Number:
- Time:
- Revision:
- Sheet
- of
- File:
- Author:

### Library data of the parts
C1#4 = Capacitor: SimulationGenericComponent: True
D1#3 = Shottky Diode: AF: 1; BV: 0; BV_MAX: 1e99; EG: 1.11; FC: 0.5; IBV: 0.001; IS: 1e-14; MJSW: 0.33; NTUN: 30; TNOM: 27; VJ: 0.3; XTI: 3; SimulationGenericComponent: True; CJO: 0; CJP: 0; CTA: 0; CTP: 0; FCS: 0.5; FV_MAX: 1e99; IKF: 0; IKR: 0; ISR: 1e-14; JSW: 0; JTUN: 0; JTUNSW: 0; KEG: 1; KF: 0; LEVEL: 1; N: 1; NBV: 1; NR: 1; NS: 1; PHP: 1; RS: 0; TCV: 0; TLEV: 0; TLEVC: 0; TM1: 0; TM2: 0; TPB: 0; TPHP: 0; TRS: 0; TRS2: 0; TT: 0; TTT1: 0; TTT2: 0; XTITUN: 3
R1#4 R2#4 R3#4 R4#4 R5#3 = Resistor: TC1: 0; SimulationGenericComponent: True; TC2: 0
U1#2 = Comparator: Ideal Comparator; SimulationGenericComponent: True
V1 = VSRC: Voltage Source; Note: PCB Footprint - Not required; AC Magnitude: 0; Published: 30-July-2020; LatestRevisionDate: 30-July-2020; LatestRevisionNote: Re-released for DXP Platform.; PackageReference: Not Applicable; Publisher: Altium Limited; AC Phase: 0
V2 = VSRC: Voltage Source; Note: PCB Footprint - Not required; AC Magnitude: 0; Time-Value Pairs: 0 0 1.136u 0 1.137u 5 2.272u 5 2.273u 0 3.409u 0 3.410u 5 4.545u 5 4.546u 0 5.681u 0 5.682u 5 6.818u 5 6.819u 0 7.955u 0 7.956u 5 9.09u 5 9.10u 0 13u 0; Published: 30-July-2020; LatestRevisionDate: 30-July-2020; LatestRevisionNote: Re-released for DXP Platform.; PackageReference: Not Applicable; Publisher: Altium Limited; AC Phase: 0

## Nets that join several sheets
GND: MCU (24 pins), RS485 Tranciever (C428.2 R444.2 U417.2 U417.8), EEPROM (5 pins), Sensors (11 pins), Connectors (8 pins), Controller (33 pins), Bridge Regulator (22 pins), Panel Mode Switch (7 pins), E-Fuse (10 pins), Bias Regulators 1 (61 pins), Bias Regulators 2 (20 pins), Backplane (9 pins), Mechanical (H2.1 H4.1 H6.1 H8.1), USB-UART Converter (CP2102) (C420.2 Q403.3 R440.2), USB-UART Converter (FT232) (C415.2 R432.2 U410.3), Illustrations 1 (18 pins), Simulation 1 (5 pins)
GND_BPLN: RS485 Tranciever (C424.2 U417.9 U417.15), Backplane (C109.2 D102.2)
GND_USB: Connectors (7 pins), USB-UART Converter (CP2102) (8 pins), USB-UART Converter (FT232) (12 pins)
PP3V3_G3H: MCU (14 pins), EEPROM (C406.1 U403.8), Sensors (11 pins), Connectors (C100.1 J101.1), Bias Regulators 1 (C534.1 U505.5), USB-UART Converter (CP2102) (C420.1 C421.1 Q403.5 R435.2), USB-UART Converter (FT232) (C415.1 C416.1 R426.2 U410.5)
PP5V0_A_G3H: Controller (11 pins), Bridge Regulator (R300.1 R301.1), Panel Mode Switch (C316.1 R323.1), Bias Regulators 1 (C516.1 U502.5), Bias Regulators 2 (10 pins)
PP5V0_D_G3H: RS485 Tranciever (C428.1 U417.1), Controller (12 pins), Bridge Regulator (C309.1 U300.17), Bias Regulators 1 (12 pins), Bias Regulators 2 (R526.1)
PP5V0_ISO_BPLN_G3H: RS485 Tranciever (C424.1 U417.16), Backplane (C109.1 D102.5)
PP5V0_USB_X: Connectors (5 pins), USB-UART Converter (CP2102) (8 pins), USB-UART Converter (FT232) (12 pins)
PP10V0_G3H: Controller (R204.1 R208.1), Bridge Regulator (C310.1 C311.1 U300.21 U300.25), Bias Regulators 1 (11 pins)
PP_PVIN_BIAS_X: Connectors (F101#1.2), Bias Regulators 1 (18 pins), Bias Regulators 2 (R516.1), Backplane (F100#2.2)
PP_PVIN_X: Connectors (C104#1.1 F100#1.2 F101#1.1 R102#1.2), Controller (R224.2), Bridge Regulator (C301.1 R305.1 R306.1 R311.1)
PP_VBUS_FUSE_S0: Controller (R227.2), Bridge Regulator (R302.1 R307.2), E-Fuse (10 pins)
PP_VBUS_S0: Bridge Regulator (D300.1), E-Fuse (8 pins), Backplane (J103.A20 J103.C18 J103.C22)
~{EEPROM_WC}: MCU (U400.34), EEPROM (U403.7)
~{STOP}: MCU (Q400.3), Controller (Q200.1 R204.2), E-Fuse (U302.4)
CTRL_RST: MCU (Q401.3 U400.24), Controller (U201.1 U202.1), Bridge Regulator (U300.15)
FUSE_OC: MCU (R406.2 U400.22), E-Fuse (U302.3)
FUSE_OK: MCU (R407.2 U400.23), E-Fuse (U302.5)
HIA: Controller (Q200.2), Bridge Regulator (U300.7)
HIB: Controller (Q203.2), Bridge Regulator (U300.8)
I2C1.SCL: MCU (R402.2 U400.45), EEPROM (U403.6), Sensors (6 pins)
I2C1.SDA: MCU (R403.2 U400.46), EEPROM (U403.5), Sensors (6 pins)
I2C2.SCL: MCU (R404.2 U400.25), Controller (U201.8)
I2C2.SDA: MCU (R405.2 U400.26), Controller (U201.9)
I_IN: Controller (U201.19), Bridge Regulator (U300.4)
I_OUT: Controller (U200.3 U201.21), Bridge Regulator (U300.11)
LIA: Controller (U201.27), Bridge Regulator (U300.6)
LIB: Controller (U201.24), Bridge Regulator (U300.9)
LTC3639_5V_EN: Bias Regulators 1 (U503.14), Bias Regulators 2 (Q503.3 R524.2)
MCU_SMBA: MCU (R401.2 U400.44), Sensors (U404.3 U406.3 U407.3 U408.3)
MCU_UART1_DE: MCU (U400.27), RS485 Tranciever (U417.4 U417.6)
MCU_UART1_PV: MCU (U400.37), RS485 Tranciever (R444.1 U417.7)
NetR408_2: MCU (R408.2), Bias Regulators 2 (R529.1 R536.2 U507.1)
NetR409_2: MCU (R409.2), Bias Regulators 2 (R530.1 R537.2 U508.1)
NetR410_2: MCU (R410.2), Bias Regulators 2 (R519.1 R523.2 U506.1)
P_PVIN_SENCE: Bridge Regulator (6 pins), Panel Mode Switch (Q304.4)
P_PVREG_SENCE: Bridge Regulator (8 pins), Panel Mode Switch (Q305.4)
PGOOD: MCU (U400.21), Bridge Regulator (U300.10)
PM_FORCE: MCU (U400.28), Controller (R225.1)
PM_OUT: Controller (U201.11), Panel Mode Switch (D309.2)
PP5V0_S_G3H: Bias Regulators 1 (C517.1 C518.1 D501.1 L501.2), Bias Regulators 2 (R527.1)
PP10V0_S_G3H: Bias Regulators 1 (5 pins), Bias Regulators 2 (R518.1)
RS485.D_N: RS485 Tranciever (U417.13), Backplane (D102.4)
RS485.D_P: RS485 Tranciever (U417.12), Backplane (D102.6)
SWD.NRST: MCU (R417.2 R418.2 R443.1 U400.10), Connectors (J101.3)
SWD.SWCLK: MCU (R416.1 U400.36), Connectors (J101.4)
SWD.SWDIO: MCU (U400.35), Connectors (J101.2)
TPS7A7001_5V0_EN: Bias Regulators 1 (Q501.1 TP506.1 U504.5), Bias Regulators 2 (Q504.3 R530.2)
TPS7A7001_10V0_EN: Bias Regulators 1 (TP503.1 U501.5), Bias Regulators 2 (Q502.3 R516.2)
UART1.Rx: MCU (U400.32), RS485 Tranciever (U417.3)
UART1.Tx: MCU (U400.29), RS485 Tranciever (U417.5)
UART_USB.Rx: MCU (U400.48), USB-UART Converter (CP2102) (R439.2)
UART_USB.Tx: MCU (U400.47), USB-UART Converter (CP2102) (C421.2 Q403.4 R435.1)
USB.D_N: Connectors (D100.3), USB-UART Converter (CP2102) (U413.5)
USB.D_P: Connectors (D100.1), USB-UART Converter (CP2102) (U413.4)

## Assembly variants
Fully Populated: not fitted C316 C419 C420 D300 D301 D306 H1 J102 R200 R201 R202 R212 R214 R300 R301 R405 R427 R429
JLCPCB SMT Assembley: not fitted C316 C419 C420 D300 D301 D306 H1 J100 J102 L100 L300 Q300 Q301 Q302 Q303 Q304 Q304 Q305 Q305 R200 R201 R202 R212 R214 R300 R301 R405 R427 R429 R505 R513 U201 U300 U301 U402 U405 U406 U408 U409 U410 U500 U503 Y400
Hand Assembley: not fitted BT400 C100 C101 C102 C103 C104 C105 C200 C201 C202 C203 C204 C205 C206 C207 C208 C209 C210 C211 C300 C301 C302 C303 C304 C305 C306 C307 C308 C309 C310 C311 C312 C313 C314 C315 C316 C317 C318 C319 C320 C321 C322 C323 C400 C401 C402 C403 C404 C405 C406 C407 C408 C409 C410 C411 C412 C413 C414 C415 C416 C417 C418 C419 C420 C500 C501 C502 C503 C504 C505 C506 C507 C508 C509 C510 C511 C512 C513 C514 C515 C516 C517 C518 C519 C520 C521 C522 C523 C524 C525 C526 C527 C528 C529 C530 C531 C532 C533 C534 C535 C536 C537 C538 C539 C540 D100 D101 D300 D301 D302 D303 D304 D305 D306 D307 D308 D309 D400 D401 D500 D501 DS400 DS401 DS402 DS403 DS404 F100 F101 H1 H2 H3 H4 H5 H6 H7 H8 H9 H10 H11 H12 H13 H14 H15 J101 J102 J103 L500 L501 Q100 Q200 Q201 Q202 Q203 Q204 Q306 Q307 Q400 Q401 Q402 Q500 Q501 Q502 Q503 Q504 R100 R101 R102 R103 R200 R201 R202 R203 R204 R205 R206 R207 R208 R209 R210 R211 R212 R213 R214 R215 R216 R217 R218 R219 R220 R221 R222 R223 R224 R225 R226 R227 R228 R229 R230 R231 R300 R301 R302 R303 R304 R305 R306 R307 R308 R309 R310 R311 R312 R313 R314 R315 R316 R317 R318 R319 R320 R321 R322 R323 R324 R325 R326 R327 R328 R329 R330 R331 R332 R333 R334 R400 R401 R402 R403 R404 R405 R406 R407 R408 R409 R410 R411 R412 R413 R414 R415 R416 R417 R418 R419 R420 R421 R422 R423 R424 R425 R426 R427 R429 R500 R501 R502 R503 R504 R505 R506 R507 R508 R509 R510 R511 R512 R513 R514 R515 R516 R517 R518 R519 R520 R521 R522 R523 R524 R525 R526 R527 R528 R529 R530 R531 R532 R533 R534 R535 R536 R537 TP500 TP501 TP502 TP503 TP504 TP505 TP506 TP507 TP508 U200 U202 U302 U400 U401 U403 U404 U407 U501 U502 U504 U505 U506 U507 U508